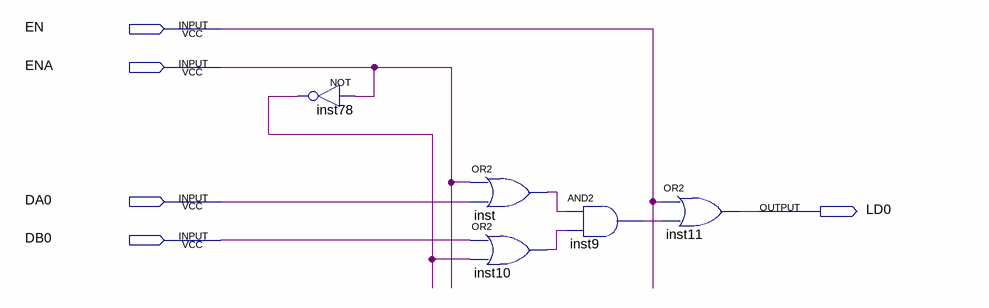
[diagram p0: schematic sheet]
// Quartus schematic 2bufer1b.bdf as structural Verilog: 5 symbols, 5 pins
module \2bufer1b  (
  input  EN,
  input  ENA,
  input  DA0,
  input  DB0,
  output LD0
);

  wire inst9_out, inst10_out, inst78_out, inst_out;

  not inst78 (inst78_out, ENA);
  or inst (inst_out, ENA, DA0);
  or inst10 (inst10_out, DB0, inst78_out);
  and inst9 (inst9_out, inst_out, inst10_out);
  or inst11 (LD0, EN, inst9_out);
endmodule
